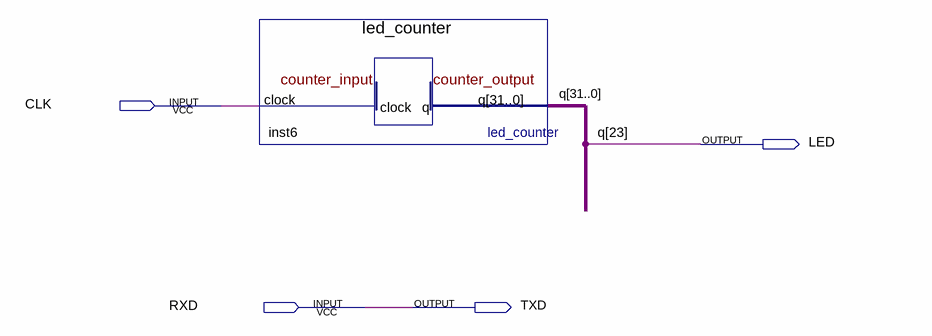
[diagram p0: schematic sheet]
// Quartus schematic hello-world.bdf as structural Verilog: 1 symbols, 4 pins
module \hello-world  (
  input  CLK,
  input  RXD,
  output LED,
  output TXD
);

  wire [31:0] q;

  led_counter inst6 (.clock(CLK), .q({q[31:24], LED, q[22:0]}));

  assign TXD = RXD;

  // Other names for the same wires on the sheet: q[23] = LED
endmodule
